# Altium schematic sheet 连接器定义.SchDoc
size A4
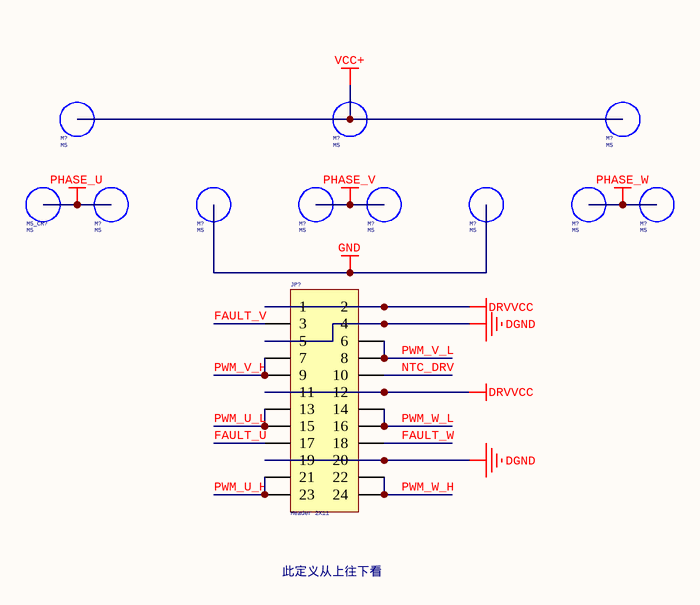
[diagram p0: 连接器定义.SchDoc]

## Parts
(Parts that share a designator on the sheet are numbered #1, #2 ... from top to bottom, then left to right.)
JP?  Header 2X11  [HDR-12X2]
M5_CR?  M5  [PCB_5M5]
M?#1  M5  [PCB_5M5]
M?#2  M5  [PCB_5M5]
M?#3  M5  [PCB_5M5]
M?#4  M5  [PCB_5M5]
M?#5  M5  [PCB_5M5]
M?#6  M5  [PCB_5M5]
M?#7  M5  [PCB_5M5]
M?#8  M5  [PCB_5M5]
M?#9  M5  [PCB_5M5]
M?#10  M5  [PCB_5M5]

## Nets
DGND: JP?.4 JP?.5 JP?.19 JP?.20
DRVVCC: JP?.1 JP?.2 JP?.11 JP?.12
GND: M?#5.1 M?#8.1
PHASE_U: M5_CR?.1 M?#4.1
PHASE_V: M?#6.1 M?#7.1
PHASE_W: M?#9.1 M?#10.1
VCC+: M?#1.1 M?#2.1 M?#3.1
FAULT_U: JP?.17
FAULT_V: JP?.3
FAULT_W: JP?.18
NTC_DRV: JP?.10
PWM_U_H: JP?.21 JP?.23
PWM_U_L: JP?.13 JP?.15
PWM_V_H: JP?.7 JP?.9
PWM_V_L: JP?.6 JP?.8
PWM_W_H: JP?.22 JP?.24
PWM_W_L: JP?.14 JP?.16

## Notes on the sheet
- 此定义从上往下看

## Library data of the parts
JP? = Header 12X2: 12*2P接插件
M5_CR? M?#1-M?#10 = M5: 接线柱